# Altium project MAX78000_PB.PrjPcb
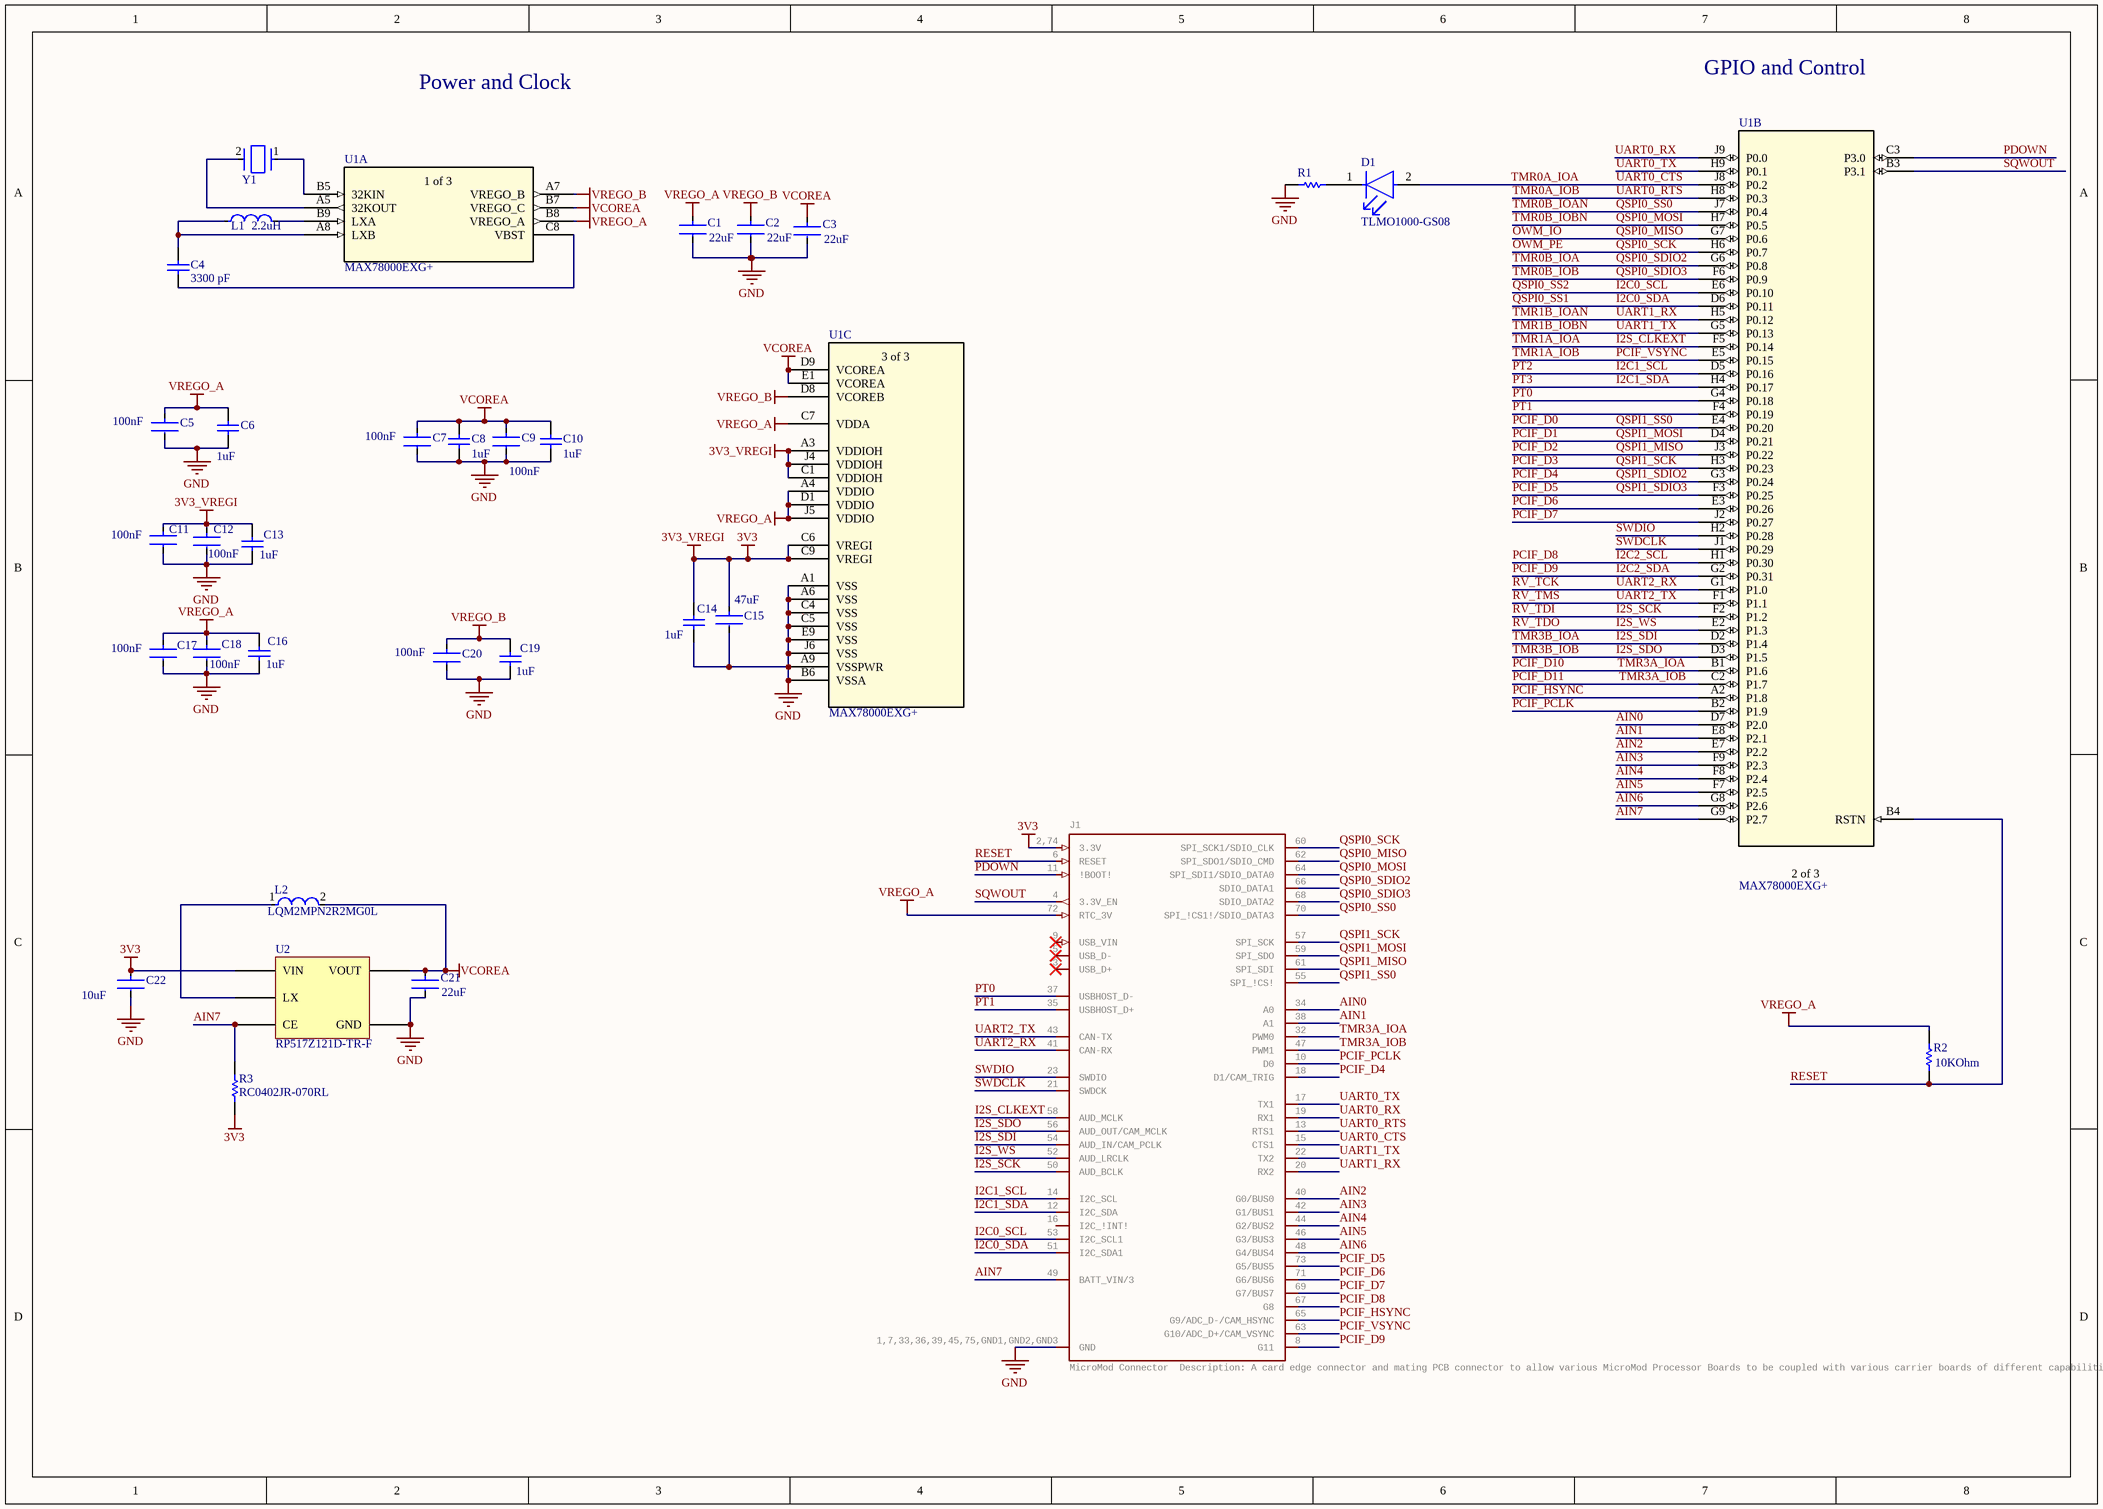
[diagram p0: Sheet1.SchDoc]
1 sheet, 32 parts. Net scope: global (net labels, ports and power ports of the same name join across sheets).
Board files: PCB1.PcbDoc, pannel_pcb.PcbDoc

## Sheet Sheet1.SchDoc
size A3; SheetNumber: 1; SheetTotal: 1

### Parts
C1  Capacitance: 22uF  [FP-CL10-IPC_A]  (hidden comment: C1608X5R0G226M080AA)
C2  Capacitance: 22uF  [FP-CL10-IPC_A]  (hidden comment: C1608X5R0G226M080AA)
C3  Capacitance: 22uF  [FP-CL10-IPC_A]  (hidden comment: C1608X5R0G226M080AA)
C4  value 3300 pF  [CAPC1005X55X25ML05T10]  (hidden comment: GRM155R71H332KA01D)
C5  Capacitance: 100nF  [FP-GRM033-0_03-MFG]  (hidden comment: GRM033R61C104KE14D)
C6  value 1uF  [CAPC1005X60X30LL05T10]  (hidden comment: C0402C105K8PAC7867)
C7  Capacitance: 100nF  [FP-GRM033-0_03-MFG]  (hidden comment: GRM033R61C104KE14D)
C8  value 1uF  [CAPC1005X60X30LL05T10]  (hidden comment: C0402C105K8PAC7867)
C9  Capacitance: 100nF  [FP-GRM033-0_03-MFG]  (hidden comment: GRM033R61C104KE14D)
C10  value 1uF  [CAPC1005X60X30LL05T10]  (hidden comment: C0402C105K8PAC7867)
C11  Capacitance: 100nF  [FP-GRM033-0_03-MFG]  (hidden comment: GRM033R61C104KE14D)
C12  Capacitance: 100nF  [FP-GRM033-0_03-MFG]  (hidden comment: GRM033R61C104KE14D)
C13  value 1uF  [CAPC1005X60X30LL05T10]  (hidden comment: C0402C105K8PAC7867)
C14  value 1uF  [CAPC1005X60X30LL05T10]  (hidden comment: C0402C105K8PAC7867)
C15  Capacitance: 47uF  [FP-GRM21B-0_2-e0_2_0_7-IPC_B]  (hidden comment: GRM21BR61A476ME15K)
C16  value 1uF  [CAPC1005X60X30LL05T10]  (hidden comment: C0402C105K8PAC7867)
C17  Capacitance: 100nF  [FP-GRM033-0_03-MFG]  (hidden comment: GRM033R61C104KE14D)
C18  Capacitance: 100nF  [FP-GRM033-0_03-MFG]  (hidden comment: GRM033R61C104KE14D)
C19  value 1uF  [CAPC1005X60X30LL05T10]  (hidden comment: C0402C105K8PAC7867)
C20  Capacitance: 100nF  [FP-GRM033-0_03-MFG]  (hidden comment: GRM033R61C104KE14D)
C21  Capacitance: 22uF  [FP-CL10-IPC_A]  (hidden comment: C1608X5R0G226M080AA)
C22  Capacitance: 10uF  [FP-GRM188-0_1-e0_2_0_55-IPC_A]  (hidden comment: GRM188R60J106ME47D)
D1  TLMO1000-GS08  [FP-6_541-5056_01-4-MFG]
J1  MicroMod Connector  Description: A card edge connector and mating PCB connector to allow various MicroMod Processor Boards to be coupled with various carrier boards of different capabilities. Based on the M.2 standard.  [M-2-CARD-E-22]
L1  Inductance: 2.2uH  [FP-MLP2012M-IPC_C]  (hidden comment: MLP2012H2R2MT0S1)
L2  LQM2MPN2R2MG0L  [FP-LQM2MPN_G0-IPC_A]
R1  ERA3AEB301V  [RESC1608X55X30LL20T20]  (value not drawn)
R2  Resistance: 10KOhm  [RESC1005X40X25LL05T05]  (hidden comment: RMCF0402JT10K0)
R3  RC0402JR-070RL  [RESC1005X40X25NL05T10]
U1  MAX78000EXG+  [21-0735_MXM]  (parts A,B,C of 3)
U2  RP517Z121D-TR-F  [WLCSP-8-P1]
Y1  9HT12-32.768KDZY-T  [FP-9HT12-MFG]  (value not drawn)

### Nets
3V3: C11.1 C12.1 C13.2 C14.2 C15.1 C22.1 J1.2,74(3.3V) R3.1 U1.A3(VDDIOH) U1.C1(VDDIOH) U1.C6(VREGI) U1.C9(VREGI) U1.J4(VDDIOH) U2.A1,_B1(VIN)  [also labelled 3V3_VREGI]
GND: C1.2 C2.2 C3.2 C5.2 C6.1 C7.2 C8.1 C9.2 C10.1 C11.2 C12.2 C13.1 C14.1 C15.2 C16.1 C17.2 C18.2 C19.1 C20.2 C21.2 C22.2 J1.1,7,33,36,39,45,75,GND1,GND2,GND3(GND) R1.1 U1.A1(VSS) U1.A6(VSS) U1.A9(VSSPWR) U1.B6(VSSA) U1.C4(VSS) U1.C5(VSS) U1.E9(VSS) U1.J6(VSS) U2.C2,_B3,_C3(GND)
VCOREA: C3.1 C7.1 C8.2 C9.1 C10.2 C21.1 L2.2 U1.B7(VREGO_C) U1.D9(VCOREA) U1.E1(VCOREA) U2.A2(VOUT)
VREGO_A: C1.1 C5.1 C6.2 C16.2 C17.1 C18.1 J1.72(RTC_3V) R2.2 U1.A4(VDDIO) U1.B8(VREGO_A) U1.C7(VDDA) U1.D1(VDDIO) U1.J5(VDDIO)
VREGO_B: C2.1 C19.2 C20.1 U1.A7(VREGO_B) U1.D8(VCOREB)
AIN0: J1.34(A0) U1.D7(P2.0)
AIN1: J1.38(A1) U1.E8(P2.1)
AIN2: J1.40(G0/BUS0) U1.E7(P2.2)
AIN3: J1.42(G1/BUS1) U1.F9(P2.3)
AIN4: J1.44(G2/BUS2) U1.F8(P2.4)
AIN5: J1.46(G3/BUS3) U1.F7(P2.5)
AIN6: J1.48(G4/BUS4) U1.G8(P2.6)
AIN7: J1.49(BATT_VIN/3) R3.2 U1.G9(P2.7) U2.A3(CE)
I2C0_SCL: J1.53(I2C_SCL1) U1.E6(P0.10)  [also labelled QSPI0_SS2]
I2C0_SDA: J1.51(I2C_SDA1) U1.D6(P0.11)  [also labelled QSPI0_SS1]
I2C1_SCL: J1.14(I2C_SCL) U1.D5(P0.16)  [also labelled PT2]
I2C1_SDA: J1.12(I2C_SDA) U1.H4(P0.17)  [also labelled PT3]
I2C2_SCL: J1.67(G8) U1.H1(P0.30)  [also labelled PCIF_D8]
I2C2_SDA: J1.8(G11) U1.G2(P0.31)  [also labelled PCIF_D9]
I2S_CLKEXT: J1.58(AUD_MCLK) U1.F5(P0.14)  [also labelled TMR1A_IOA]
I2S_SCK: J1.50(AUD_BCLK) U1.F2(P1.2)  [also labelled RV_TDI]
I2S_SDI: J1.54(AUD_IN/CAM_PCLK) U1.D2(P1.4)  [also labelled TMR3B_IOA]
I2S_SDO: J1.56(AUD_OUT/CAM_MCLK) U1.D3(P1.5)  [also labelled TMR3B_IOB]
I2S_WS: J1.52(AUD_LRCLK) U1.E2(P1.3)  [also labelled RV_TDO]
OWM_IO: J1.62(SPI_SDO1/SDIO_CMD) U1.G7(P0.6)  [also labelled QSPI0_MISO]
OWM_PE: J1.60(SPI_SCK1/SDIO_CLK) U1.H6(P0.7)  [also labelled QSPI0_SCK]
PCIF_D0: J1.55(SPI_!CS!) U1.E4(P0.20)  [also labelled QSPI1_SS0]
PCIF_D1: J1.59(SPI_SDO) U1.D4(P0.21)  [also labelled QSPI1_MOSI]
PCIF_D2: J1.61(SPI_SDI) U1.J3(P0.22)  [also labelled QSPI1_MISO]
PCIF_D3: J1.57(SPI_SCK) U1.H3(P0.23)  [also labelled QSPI1_SCK]
PCIF_D4: J1.18(D1/CAM_TRIG) U1.G3(P0.24)  [also labelled QSPI1_SDIO2]
PCIF_D5: J1.73(G5/BUS5) U1.F3(P0.25)  [also labelled QSPI1_SDIO3]
PCIF_D6: J1.71(G6/BUS6) U1.E3(P0.26)
PCIF_D7: J1.69(G7/BUS7) U1.J2(P0.27)
PCIF_D10: J1.32(PWM0) U1.B1(P1.6)  [also labelled TMR3A_IOA]
PCIF_D11: J1.47(PWM1) U1.C2(P1.7)  [also labelled TMR3A_IOB]
PCIF_HSYNC: J1.65(G9/ADC_D-/CAM_HSYNC) U1.A2(P1.8)
PCIF_PCLK: J1.10(D0) U1.B2(P1.9)
PCIF_VSYNC: J1.63(G10/ADC_D+/CAM_VSYNC) U1.E5(P0.15)  [also labelled TMR1A_IOB]
PDOWN: J1.11(!BOOT!) U1.C3(P3.0)
PT0: J1.37(USBHOST_D-) U1.G4(P0.18)
PT1: J1.35(USBHOST_D+) U1.F4(P0.19)
QSPI0_MOSI: J1.64(SPI_SDI1/SDIO_DATA0) U1.H7(P0.5)  [also labelled TMR0B_IOBN]
QSPI0_SDIO2: J1.66(SDIO_DATA1) U1.G6(P0.8)  [also labelled TMR0B_IOA]
QSPI0_SDIO3: J1.68(SDIO_DATA2) U1.F6(P0.9)  [also labelled TMR0B_IOB]
QSPI0_SS0: J1.70(SPI_!CS1!/SDIO_DATA3) U1.J7(P0.4)  [also labelled TMR0B_IOAN]
RESET: J1.6(RESET) R2.1 U1.B4(RSTN)
RV_TCK: J1.41(CAN-RX) U1.G1(P1.0)  [also labelled UART2_RX]
RV_TMS: J1.43(CAN-TX) U1.F1(P1.1)  [also labelled UART2_TX]
SQWOUT: J1.4(3.3V_EN) U1.B3(P3.1)
SWDCLK: J1.21(SWDCK) U1.J1(P0.29)
SWDIO: J1.23(SWDIO) U1.H2(P0.28)
TMR0A_IOA: D1.2(A) J1.15(CTS1) U1.J8(P0.2)  [also labelled UART0_CTS]
TMR0A_IOB: J1.13(RTS1) U1.H8(P0.3)  [also labelled UART0_RTS]
TMR1B_IOAN: J1.20(RX2) U1.H5(P0.12)  [also labelled UART1_RX]
TMR1B_IOBN: J1.22(TX2) U1.G5(P0.13)  [also labelled UART1_TX]
UART0_RX: J1.19(RX1) U1.J9(P0.0)
UART0_TX: J1.17(TX1) U1.H9(P0.1)
NetC4_1: C4.1 U1.C8(VBST)
NetC4_2: C4.2 L1.1 U1.A8(LXB)
NetD1_1: D1.1(C) R1.2
NetL1_2: L1.2 U1.B9(LXA)
NetL2_1: L2.1 U2.C1(LX)
NetU1_A5: U1.A5(32KOUT) Y1.2
NetU1_B5: U1.B5(32KIN) Y1.1

Not connected (* = marked no-connect by the designer): J1 3(USB_D+)* 5(USB_D-)* 9(USB_VIN)* 16(I2C_!INT!)

### Notes on the sheet
- Power and Clock
- GPIO and Control
- (in symbol MAX78000EXG+, part A) 1 of 3
- (in symbol MAX78000EXG+, part B) 2 of 3
- (in symbol MAX78000EXG+, part C) 3 of 3

### Library data of the parts
C1-C3 C21 = CMP-13271-002755-1: Cap Ceramic 22uF 16V X5R ±20% Pad SMD 0603 +85°C T/R; Mount: Surface Mount; Packaging: Tape and Reel; Case Code (Imperial): 0603; Max Operating Temperature: 85°C; Case/Package: 0603; Voltage Rating: 16V; Tolerance: 20%; Case Code (Metric): 1608; Min Operating Temperature: -55°C
C4 = CMP-2008-04658-1: Manufacturer: Murata; Part Number: GRM155R71H332KA01D
C5 C7 C9 C11 C12 C17 C18 C20 = CMP-06035-039275-1: Chip Multilayer Ceramic Capacitors for General Purpose, 0201, 0.10uF, X5R, 15%, 10%, 16V; Length: 600um; Dielectric: X5R; Tolerance: 10%; Thickness: 300um; Voltage Rating (DC): 16V; Width: 300um
C6 C8 C10 C13 C14 C16 C19 = CMP-2008-02081-1: Manufacturer: Kemet; Part Number: C0402C105K8PAC7867
C15 = CMP-06035-042633-1: Chip Multilayer Ceramic Capacitors for General Purpose, 0805, 47uF, X5R, 15%, 20%, 10V; Min Operating Temperature: -55°C; Max Operating Temperature: 85°C; Length: 0.079inch; Case Code (Imperial): 0805; Tolerance: 20%; Mount: Surface Mount; Voltage Rating (DC): 10V; Termination: SMD/SMT; Voltage Rating: 10V; Weight: 0.000335oz; Package Quantity: 10000; Dielectric: X5R; Thickness: 0.057inch; Case/Package: 0805; Width: 0.049inch; Case Code (Metric): 2012; Packaging: Tape and Reel
C22 = CMP-2006-02792-2: Chip Multilayer Ceramic Capacitors for General Purpose, 0603, 10uF, X5R, 15%, 20%, 6.3V; Packaging: Tape and Reel; Voltage Rating (DC): 6.3V; Width: 0.031inch; Termination: SMD/SMT; Dielectric: X5R; Package Quantity: 4000; Voltage Rating: 6.3V; Case/Package: 0603; Min Operating Temperature: -55°C; Voltage: 6.3V; Length: 1.6mm; Thickness: 0.035inch; Lead Free: Lead Free; Depth: 0.8mm; Case Code (Imperial): 0603; Max Operating Temperature: 85°C; Material: Ceramic; Height: 0.8mm; Tolerance: 20%; Mount: Surface Mount; REACH SVHC: No SVHC; Radiation Hardening: No; Case Code (Metric): 1608
D1 = CMP-02520-000010-1: LED ORANGE 0603 SMD; Manufacturer: Vishay; Automotive Grade: Grade 2; Luminous Intensity: 7.5mcd; Forward Current: 2mA; Forward Voltage: 1.8V; Led Orientation: Top View; Power Dissipation: 40mW; Max Junction Temp: +120°C; Wavelength: 605nm; Viewing Angle: 160°; Peak Emmision Wavelength: 610nm; Reverse Voltage: 6V; Colour: Orange; Digikey Description: LED ORANGE 0603 SMD; Lead Free: Yes; RoHS: TRUE; Device Class L1: Optoelectronics; Automotive: Yes; Manufacturer Part Number: TLMO1000-GS08; Category: Diode; Device Class L3: unset; Temperature Range Low: -40°C; Temperature Range High: +100°C; Ambient Temperature Range High: +100°C; ComponentLink2URL: http://www.vishay.com/docs/83172/tlmo1000.pdf; Height: 0.65mm; Ambient Temperature Range Low: -40°C; Device Class L2: LEDs; Octopart: https://octopart.com/tlmo1000-gs08-vishay-41955669; Temperature: -40°C to +100°C; ComponentLink2Description: Datasheet; Package: 6.541-5056.01-4
J1 = MICROMOD-2222: GateName_1: J1; DeviceName: -2222; SymbolName_1: MICROMOD; LibraryName: SparkFun-MicroMod; DeviceSetName: MICROMOD; Package: M.2-CARD-E-22
L1 = CMP-08253-000154-1: Shielded Multilayer Inductor 2.2uH ±20% 1000mA 195mΩ SMD 0805; DC Resistance (DCR): 195mR; Core Material: Ferrite; Test Frequency: 2MHz; Current Rating: 1A; Packaging: Tape and Reel; Length: 0.079inch; Tolerance: 20%; Case/Package: 0805; Case Code (Imperial): 0805; Min Operating Temperature: -40°C; Case Code (Metric): 2012; Shielding: Shielded; Mount: Surface Mount; Lead Free: Lead Free; Height - Seated (Max): 0.039inch; Max Operating Temperature: 125°C; RoHS Compliant: Yes; Package Quantity: 4000; Width: 0.049inch
L2 = CMP-06042-008995-1: Multilayer Type Inductor for Power Lines, 0806 (2016), 2.2μH, 20%, 0.138Ω, 1.2A; DC Resistance (DCR): 138mR; Inductance: 2.2uH; Self Resonant Frequency: 40MHz; Core Material: Ferrite; Shielding: Shielded; Test Frequency: 1MHz; Weight: 0.000353oz; Termination: SMD/SMT; Case Code (Metric): 2012; Height - Seated (Max): 0.039inch; Max Operating Temperature: 125°C; Length: 0.079inch; Max DC Current: 1.2A; Package Quantity: 3000; Width: 0.049inch; Min Operating Temperature: -55°C; Packaging: Tape and Reel; Height: 0.9mm; Tolerance: 20%; Mount: Surface Mount; Case/Package: 0805; Current Rating: 1.2A; Case Code (Imperial): 0805
R1 = CMP-2000-00025-1: Manufacturer: Panasonic; Part Number: ERA3AEB301V
R2 = CMP-2000-07588-1: Chip Resistor, 10 KOhm, +/- 1%, 0.1 W, -55 to 155 degC, 0402 (1005 Metric), RoHS, Tape and Reel; Manufacturer: Panasonic; Power Rating: 100mW; Voltage Rating: 50V; Case\/Package: 0402; Temperature Coefficient: 100ppm\/degreesC; RoHSCompliant: True; Lead Free: LeadFree; Package Quantity: 1; Contact Plating: Tin; Length: 1mm; Radiation Hardening: No; REACH SVHC: NoSVHC; Max Operating Temperature: 155degC; Depth: 0.5mm; Case Code (Imperial): 0402; Military Standard: Not; Package Description: 2-Pin Surface Mount Device, Body 1 x 0.5 mm; Termination: SMD/SMT; Case Code (Metric): 1005; Height: 0.35mm; Packaging: TapeandReel; Voltage Rating (DC): 50V; Package Reference: 402; Number of Pins: 2; Tolerance: 1%; Mounting Technology: SurfaceMount; Width: 0.02inch; Mount: SurfaceMount; Datasheet URL: https://industrial.panasonic.com/cdbs/www-data/pdf/RDA0000/AOA0000C304.pdf; Composition: ThickFilm; Datasheet Version: 02/2017; Manufacturer URL: http://www.panasonic.com/; Max Power Dissipation: 100mW; Number of Terminations: 2; Min Operating Temperature: -55degC
R3 = CMP-1011-00001-2: Manufacturer: Yageo / Phycomp; Part Number: RC0402JR-070RL
U1 = MAX78000EXG+: No Description Available; Built_By: EMA_April; Vendor: Maxim Integrated Products; SourceLibrary: Add_to_database_2021-03-26; Copyright: Copyright (C) 2018 Accelerated Designs. All rights reserved; Manufacturer_Part_Number: MAX78000EXG+; RefDes: RefDes; Type: DEV
U2 = Component_1
Y1 = CMP-18717-000010-1: CRYSTAL 32.7680KHZ 7PF SMD; ESR (Equivalent Series Resistance): 90kR; Frequency: 32.768kHz; Frequency Tolerance: 20ppm; Packaging: Tape and Reel; Load Capacitance: 7pF; Min Operating Temperature: -40°C; Length: 0.063inch; Mount: Surface Mount; Height: 0.02inch; Width: 0.039inch; Case/Package: SMD/SMT; Lead Free: Lead Free; Max Operating Temperature: 85°C